# EAGLE design oneDpong (EAGLE 6.6.0)
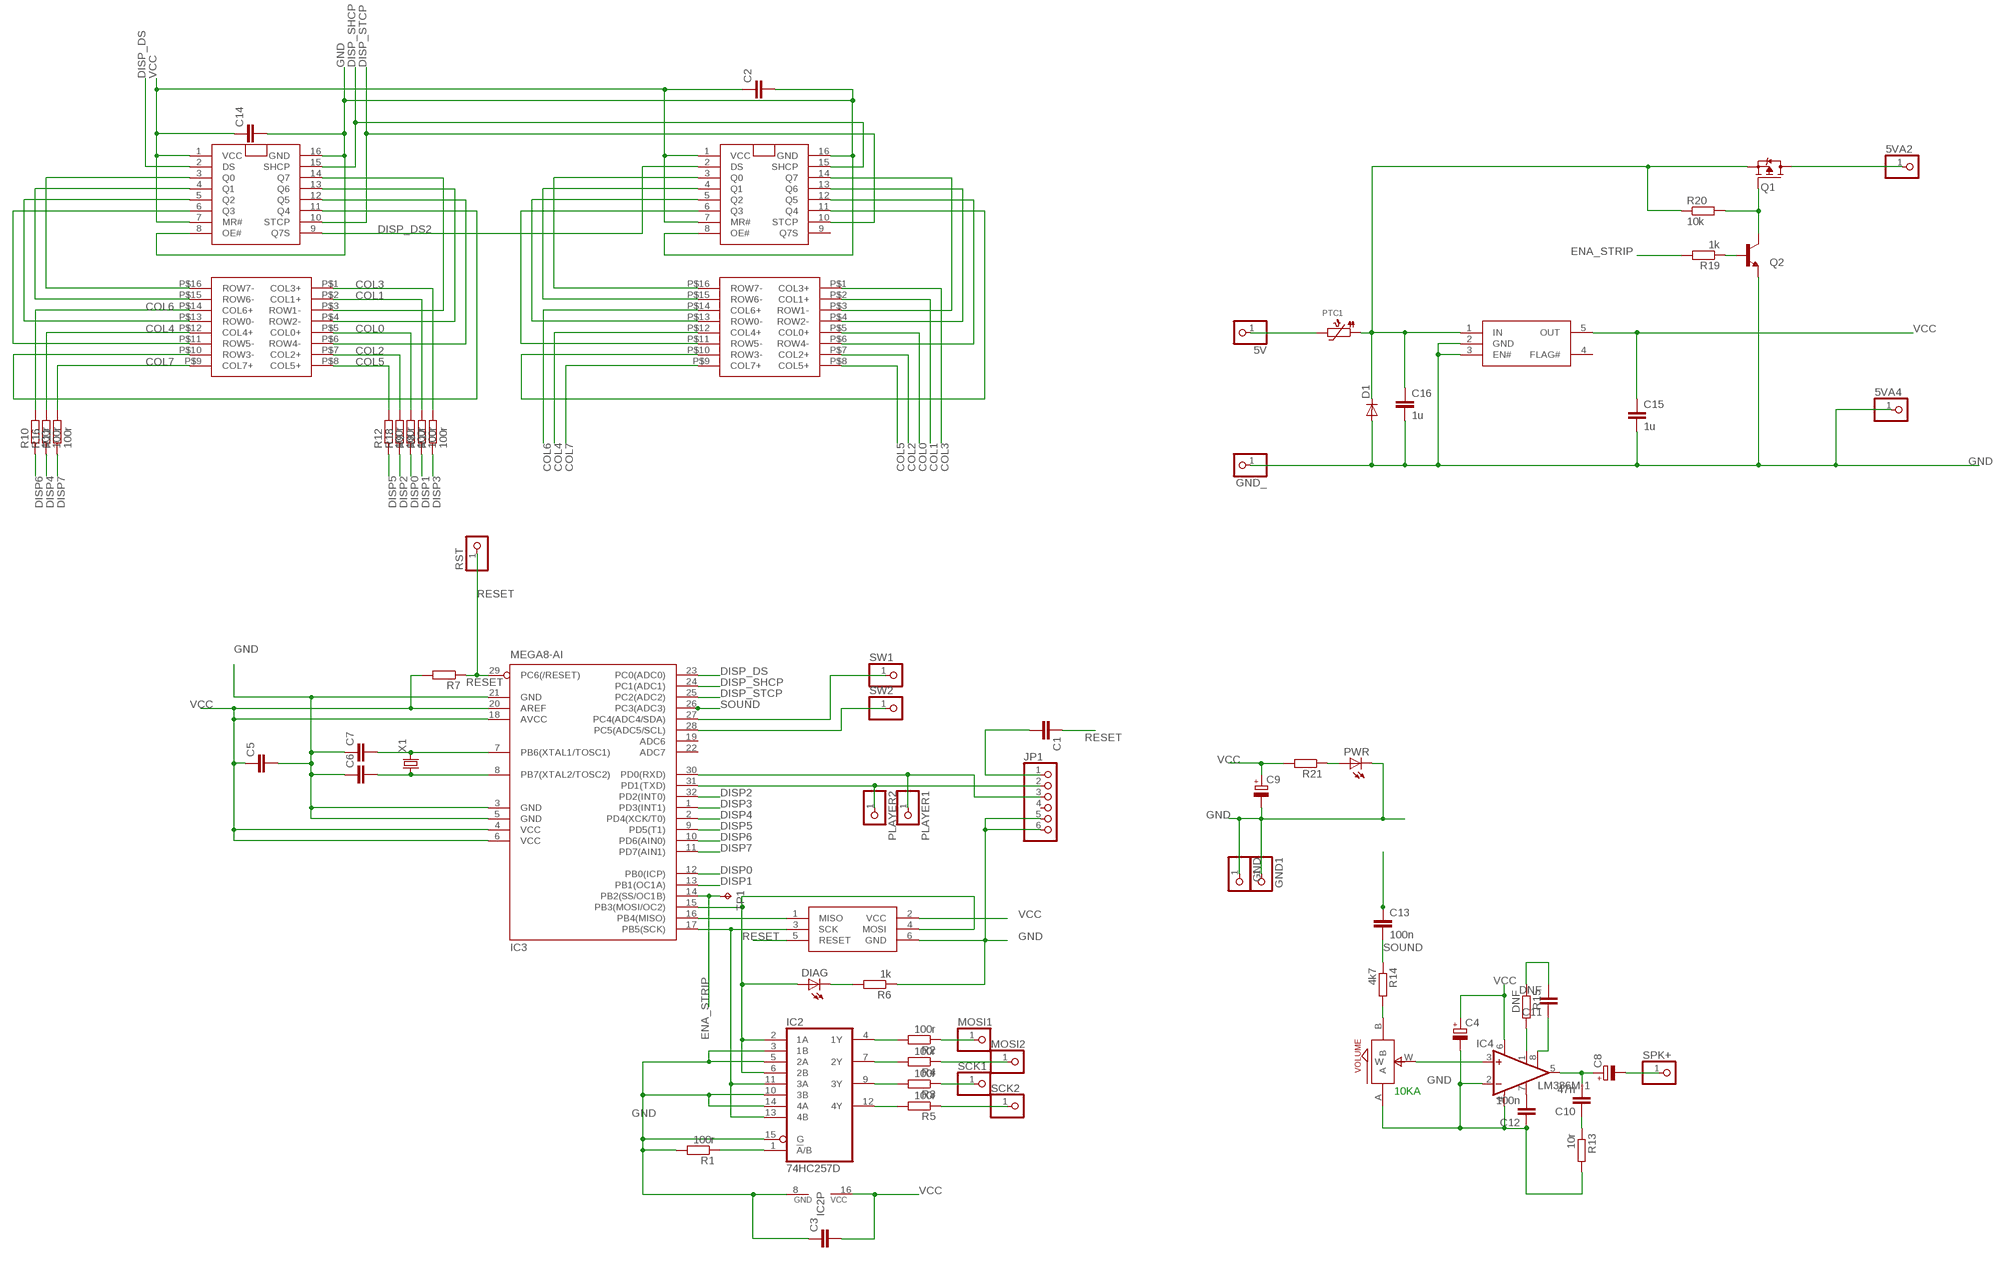
[diagram p0: schematic, sheet 1]

## Parts
5V  PINHD-1X1  [1X01]
5VA2  PINHD-1X1  [1X01]
5VA4  PINHD-1X1  [1X01]
C1  C-EUC0805  [C0805]
C2  C-EUC0805  [C0805]
C3  C-EUC0805  [C0805]
C4  CPOL-EUE2.5-6  [E2,5-6]
C5  C-EUC0805  [C0805]
C6  C-EUC0805  [C0805]
C7  C-EUC0805  [C0805]
C8  CPOL-EUE2.5-6  [E2,5-6]
C9  CPOL-EUE2.5-6  [E2,5-6]
C10  47n  C-EUC0805  [C0805]
C11  DNF  C-EUC0805  [C0805]
C12  100n  C-EUC0805  [C0805]
C13  100n  C-EUC0805  [C0805]
C14  C-EUC0805  [C0805]
C15  1u  C-EUC0805  [C0805]
C16  1u  C-EUC0805  [C0805]
D1  DIODE-SMC  [SMC]
DIAG  LED3MM  [LED3MM]
GND  PINHD-1X1  [1X01]
GND1  PINHD-1X1  [1X01]
GND_  PINHD-1X1  [1X01]
IC1  NPIC6C596  [SO16]
IC2  74HC257D  [SO16]
IC3  MEGA8-AI  [TQFP32-08]
IC4  LM386M-1  [SO08]
IC5  NPIC6C596  [SO16]
IC6  NCP361SNT1G  [SOT23-5]
ICSP  TAG_CONN_AVR  [TC2030-MCP-NL]
JP1  PINHD-1X6  [1X06]
MOSI1  PINHD-1X1  [1X01]
MOSI2  PINHD-1X1  [1X01]
PLAYER1  PINHD-1X1  [1X01]
PLAYER2  PINHD-1X1  [1X01]
PTC1  PTC1812  [PTC1812]
PWR  LED3MM  [LED3MM]
Q1  SPD30P06PTO252  [TO252]
Q2  MMBT3904LT1-NPN-SOT23-BEC  [SOT23-BEC]
R1  100r  R-EU_R0805  [R0805]
R2  100r  R-EU_R0805  [R0805]
R3  100r  R-EU_R0805  [R0805]
R4  100r  R-EU_R0805  [R0805]
R5  100r  R-EU_R0805  [R0805]
R6  1k  R-EU_R0805  [R0805]
R7  R-EU_R0805  [R0805]
R8  100r  R-EU_R0805  [R0805]
R9  100r  R-EU_R0805  [R0805]
R10  100r  R-EU_R0805  [R0805]
R11  100r  R-EU_R0805  [R0805]
R12  100r  R-EU_R0805  [R0805]
R13  10r  R-EU_R0805  [R0805]
R14  4k7  R-EU_R0805  [R0805]
R15  DNF  R-EU_R0805  [R0805]
R16  100r  R-EU_R0805  [R0805]
R17  100r  R-EU_R0805  [R0805]
R18  100r  R-EU_R0805  [R0805]
R19  1k  R-EU_R0805  [R0805]
R20  10k  R-EU_R0805  [R0805]
R21  R-EU_R0805  [R0805]
RST  PINHD-1X1  [1X01]
SCK1  PINHD-1X1  [1X01]
SCK2  PINHD-1X1  [1X01]
SPK+  PINHD-1X1  [1X01]
SW1  PINHD-1X1  [1X01]
SW2  PINHD-1X1  [1X01]
TP1  TPB1,27  [B1,27]
U$1  LARGE8X8  [LARGE8X8]
U$2  LARGE8X8  [LARGE8X8]
VOLUME  ALPS_POT_SMALL  [SMALL_ALPS_POT]
X1  CRYSTALHC49U-V  [HC49U-V]

## Nets
COL0: R9.2 U$1.P$5(COL0+) U$2.P$5(COL0+)
COL1: R8.2 U$1.P$2(COL1+) U$2.P$2(COL1+)
COL2: R18.2 U$1.P$7(COL2+) U$2.P$7(COL2+)
COL3: R17.2 U$1.P$1(COL3+) U$2.P$1(COL3+)
COL4: R16.2 U$1.P$12(COL4+) U$2.P$12(COL4+)
COL5: R12.2 U$1.P$8(COL5+) U$2.P$8(COL5+)
COL6: R10.2 U$1.P$14(COL6+) U$2.P$14(COL6+)
COL7: R11.2 U$1.P$9(COL7+) U$2.P$9(COL7+)
DISP0: IC3.12(PB0(ICP)) R9.1
DISP1: IC3.13(PB1(OC1A)) R8.1
DISP2: IC3.32(PD2(INT0)) R18.1
DISP3: IC3.1(PD3(INT1)) R17.1
DISP4: IC3.2(PD4(XCK/T0)) R16.1
DISP5: IC3.9(PD5(T1)) R12.1
DISP6: IC3.10(PD6(AIN0)) R10.1
DISP7: IC3.11(PD7(AIN1)) R11.1
DISP_DS: IC3.23(PC0(ADC0)) IC5.2(DS)
DISP_DS2: IC1.2(DS) IC5.9(Q7S)
DISP_SHCP: IC1.15(SHCP) IC3.24(PC1(ADC1)) IC5.15(SHCP)
DISP_STCP: IC1.10(STCP) IC3.25(PC2(ADC2)) IC5.10(STCP)
ENA_STRIP: IC3.14(PB2(SS/OC1B)) R19.2 TP1.TP
GND: 5VA4.1 C2.2 C3.1 C4.- C5.2 C6.1 C7.1 C9.- C12.1 C14.2 C15.2 C16.2 D1.A GND1.1 GND.1 GND_.1 IC1.8(OE#) IC1.16(GND) IC2.3(1B) IC2.5(2A) IC2.8(GND) IC2.10(3B) IC2.14(4A) IC2.15(G) IC3.3(GND) IC3.5(GND) IC3.21(GND) IC4.2(-IN) IC4.4(GND) IC5.8(OE#) IC5.16(GND) IC6.2(GND) IC6.3(EN#) ICSP.6(GND) JP1.5 JP1.6 PWR.K(C) Q2.E R1.2 R6.1 R13.2 VOLUME.A
MISO: IC3.16(PB4(MISO)) ICSP.1(MISO)
MOSI2: MOSI2.1 R4.1
N$1: IC3.30(PD0(RXD)) JP1.3 PLAYER1.1
N$2: IC2.1(!A!/B) R1.1
N$3: C7.2 IC3.7(PB6(XTAL1/TOSC1)) X1.2
N$4: C6.2 IC3.8(PB7(XTAL2/TOSC2)) X1.1
N$5: IC2.4(1Y) R2.2
N$6: IC2.7(2Y) R4.2
N$7: IC2.11(3A) IC2.13(4B) IC3.17(PB5(SCK)) ICSP.3(SCK)
N$8: C10.1 R13.1
N$9: C1.2 JP1.1
N$10: IC2.9(3Y) R3.2
N$11: IC2.12(4Y) R5.2
N$12: MOSI1.1 R2.1
N$13: 5VA2.1 Q1.3(D)
N$14: IC3.31(PD1(TXD)) JP1.2 PLAYER2.1
N$15: R5.1 SCK2.1
N$16: R14.2 VOLUME.B
N$17: IC4.3(+IN) VOLUME.W
N$18: IC3.28(PC5(ADC5/SCL)) SW2.1
N$19: C8.+ C10.2 IC4.5(OUT)
N$20: C8.- SPK+.1
N$21: C12.2 IC4.7(BYPASS)
N$22: IC4.1(GAIN) R15.2
N$23: C11.2 R15.1
N$24: C11.1 IC4.8(GAIN)
N$25: C13.2 R14.1
N$26: PWR.A R21.1
N$27: DIAG.K(C) R6.2
N$28: 5V.1 PTC1.P$2
N$29: Q1.1(G) Q2.C R20.2
N$30: Q2.B R19.1
PMOSI: DIAG.A IC2.2(1A) IC2.6(2B) IC3.15(PB3(MOSI/OC2)) ICSP.4(MOSI)
Q0A: IC5.3(Q0) U$1.P$16(ROW7-)
Q0A1: IC1.3(Q0) U$2.P$16(ROW7-)
Q1A: IC5.4(Q1) U$1.P$15(ROW6-)
Q1A1: IC1.4(Q1) U$2.P$15(ROW6-)
Q2A: IC5.5(Q2) U$1.P$13(ROW0-)
Q2A1: IC1.5(Q2) U$2.P$13(ROW0-)
Q3A: IC5.6(Q3) U$1.P$11(ROW5-)
Q3A1: IC1.6(Q3) U$2.P$11(ROW5-)
Q4A: IC5.11(Q4) U$1.P$10(ROW3-)
Q4A1: IC1.11(Q4) U$2.P$10(ROW3-)
Q5A: IC5.12(Q5) U$1.P$6(ROW4-)
Q5A1: IC1.12(Q5) U$2.P$6(ROW4-)
Q6A: IC5.13(Q6) U$1.P$4(ROW2-)
Q6A1: IC1.13(Q6) U$2.P$4(ROW2-)
Q7A: IC5.14(Q7) U$1.P$3(ROW1-)
Q7A1: IC1.14(Q7) U$2.P$3(ROW1-)
RESET: C1.1 IC3.29(PC6(/RESET)) ICSP.5(RESET) R7.1 RST.1
SCK1: R3.1 SCK1.1
SOUND: C13.1 IC3.26(PC3(ADC3))
SW1: IC3.27(PC4(ADC4/SDA)) SW1.1
VCC: C2.1 C3.2 C4.+ C5.1 C9.+ C14.1 C15.1 IC1.1(VCC) IC1.7(MR#) IC2.16(VCC) IC3.4(VCC) IC3.6(VCC) IC3.18(AVCC) IC3.20(AREF) IC4.6(VS) IC5.1(VCC) IC5.7(MR#) IC6.5(OUT) ICSP.2(VCC) R7.2 R21.2
VIN: C16.1 D1.C IC6.1(IN) PTC1.P$1 Q1.2(S) R20.1
Unconnected: IC1.9(Q7S) IC3.19(ADC6) IC3.22(ADC7) IC6.4(FLAG#) JP1.4

## Notes on the sheet
- 10KA

## Library data of the parts
5V 5VA2 5VA4 GND GND1 GND_ MOSI1 MOSI2 PLAYER1 PLAYER2 RST SCK1 SCK2 SPK+ SW1 SW2 = pinhead:PINHD-1X1: PIN HEADER
C1-C3 C5-C7 C10-C16 = rcl:C-EU: CAPACITOR, European symbol
C4 C8 C9 = rcl:CPOL-EU: POLARIZED CAPACITOR, European symbol
D1 = diode:DIODE-: DIODE
DIAG PWR = adafruit:LED: LED OSRAM: - CHIPLED LG R971, LG N971, LY N971, LG Q971, LY Q971, LO R971, LY R971 LH N974, LH R974 LS Q976, LO Q976, LY Q976 LO Q996 - Hyper CHIPLED LW Q18S LB Q993, LB Q99A, LB R99A - SideLED LS A670, LO A670, LY A670, LG A670, LP A670 LB A673, LV A673, LT A673, LW A673 LH A674 LY A675 LS A676, LA A676, LO A676, LY A676, LW A676 LS A679, LY A679, LG A679 - Hyper Micro SIDELED® LS Y876, LA Y876, LO Y876, LY Y876 LT Y87S - SmartLED LW L88C, LW L88S LB L89C, LB L89S, LG L890 LS L89K, LO L89K, LY L89K LS L896, LA L896, LO L896, LY L896 - TOPLED LS T670, LO T670, LY T670, LG T670, LP T670 LSG T670, LSP T670, LSY T670, LOP T670, LYG T670 LG T671, LOG T671, LSG T671 LB T673, LV T673, LT T673, LW T673 LH T674 LS T676, LA T676, LO T676, LY T676, LB T676, LH T676, LSB T676, LW T676 LB T67C, LV T67C, LT T67C, LS T67K, LO T67K, LY T67K, LW E67C LS E67B, LA E67B, LO E67B, LY E67B, LB E67C, LV E67C, LT E67C LW T67C LS T679, LY T679, LG T679 LS T770, LO T770, LY T770, LG T770, LP T770 LB T773, LV T773, LT T773, LW T773 LH T774 LS E675, LA E675, LY E675, LS T675 LS T776, LA T776, LO T776, LY T776, LB T776 LHGB T686 LT T68C, LB T68C - Hyper Mini TOPLED® LB M676 - Mini TOPLED Santana® LG M470 LS M47K, LO M47K, LY M47K Source: http://www.osram.convergy.de/
IC1 IC5 = jasons_stuff:NPIC6C596
IC2 = 74xx-eu:74*257: Quadruple 2-to 1 line data SELECTOR/MULTIPLEXER
IC3 = atmel:MEGA8: MICROCONTROLLER 8 Kbytes FLASH, 1 kbytes SRAM, 512 bytes EEPROM, USART, 6-channel 10 bit ADC, 2-channel 8 bit ADC Pin compatible with Atmega48, ATMega88, ATMega168 Source: avr.lbr; MPN: ATMEGA8-16AU; OC_FARNELL: 9171371; OC_NEWARK: 73M8863
IC4 = linear:LM386?-*: Low Voltage Audio Power Amplifier Source: http://cache.national.com/ds/LM/LM386.pdf
IC6 = jason_eagle6:NCP361SNT1G
ICSP = jasons_stuff:TAG_CONN_AVR
JP1 = pinhead:PINHD-1X6: PIN HEADER
PTC1 = microbuilder:PTC: PTC (Resettable Fuse) 1206 Package 250mA PTC (16V Max, Time-to-Trip: 0.08s) - Digikey: F2110CT-ND 1210 Package 100mA PTC (30V Max, Time-to-Trip: 0.6s) - Digikey: MF-USMF010-2CT-ND 1812 Package 750mA PTC (24V Max, Time-to-Trip: 0.2s) - Digikey: MF-MSMF075/24-2CT-ND
Q1 = transistor-fet:SPD30P06P: SIPMOS(R) Power-Transistor P-Channel, Enhancement mode Source: http://www.infineon.com/upload/Document/cmc_upload/documents/012/3615/SPD_U30P06P.pdf
Q2 = transistor:*-NPN-: NPN Transistror BF959 corrected 2008.03.06
R1-R21 = rcl:R-EU_: RESISTOR, European symbol
TP1 = testpad:TP: Test pad
U$1 U$2 = jasons_stuff:LARGE8X8
VOLUME = jasons_stuff:ALPS_POT_SMALL
X1 = crystal:CRYSTAL: CRYSTAL; OC_FARNELL: 1666969; OC_NEWARK: unknown

## Board
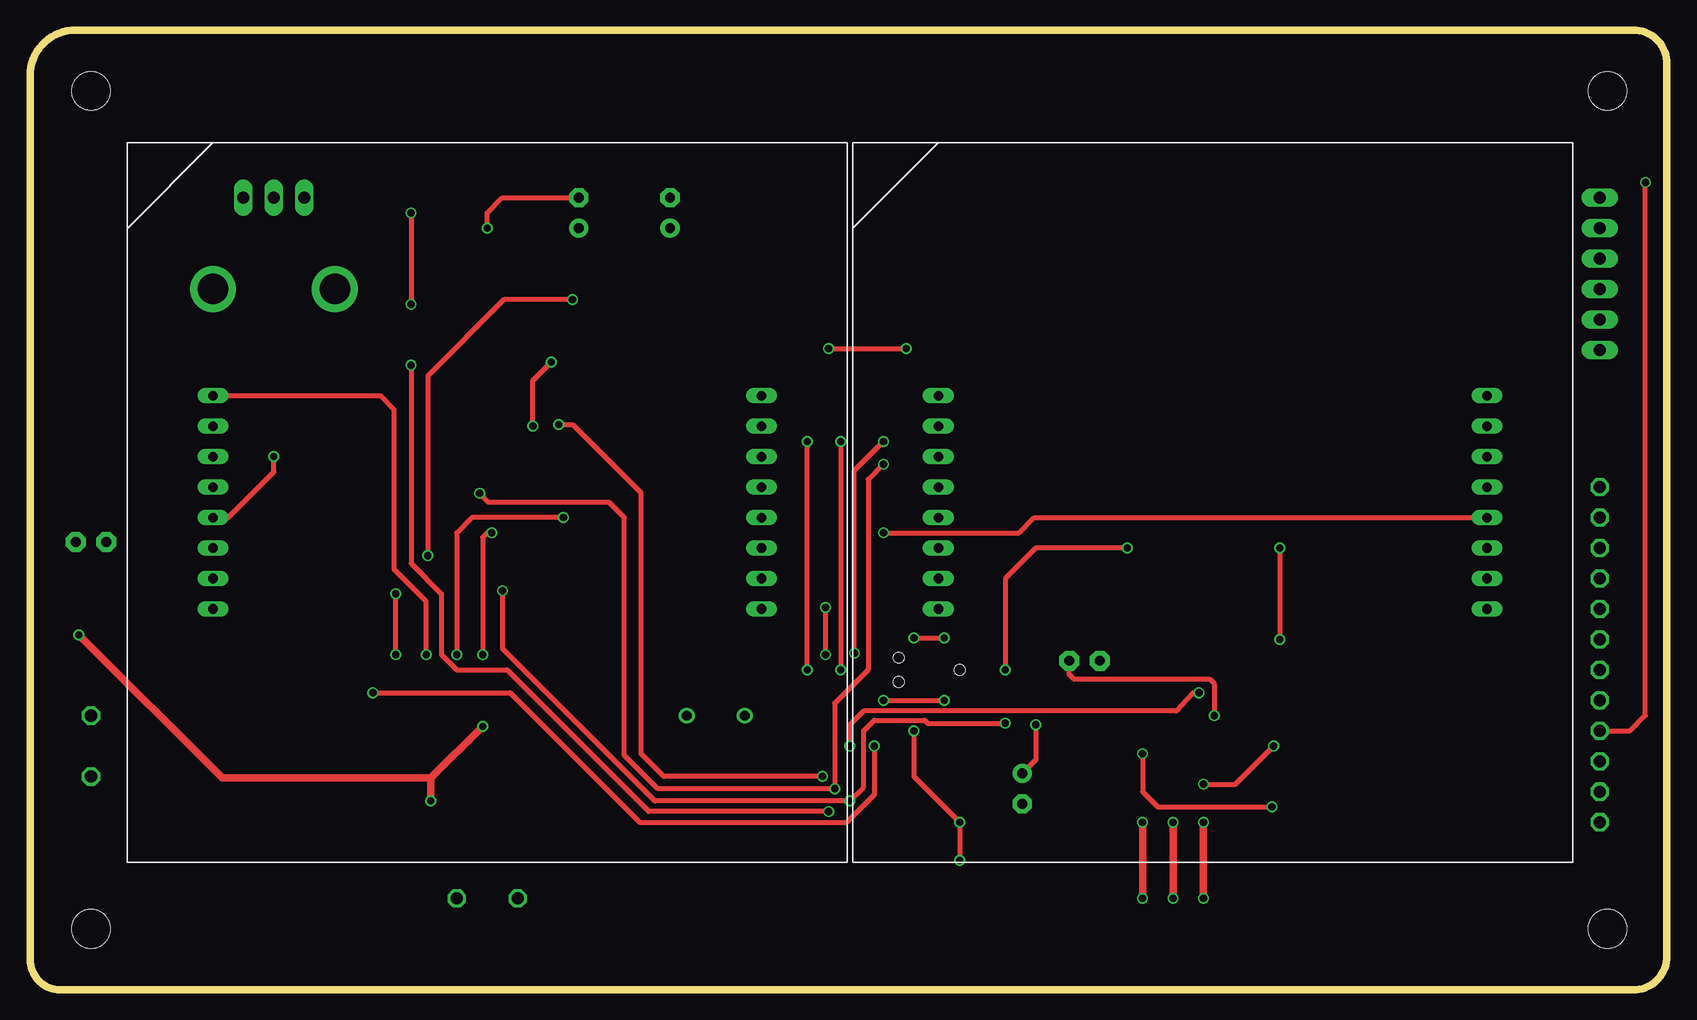
[diagram p1: board, top side]
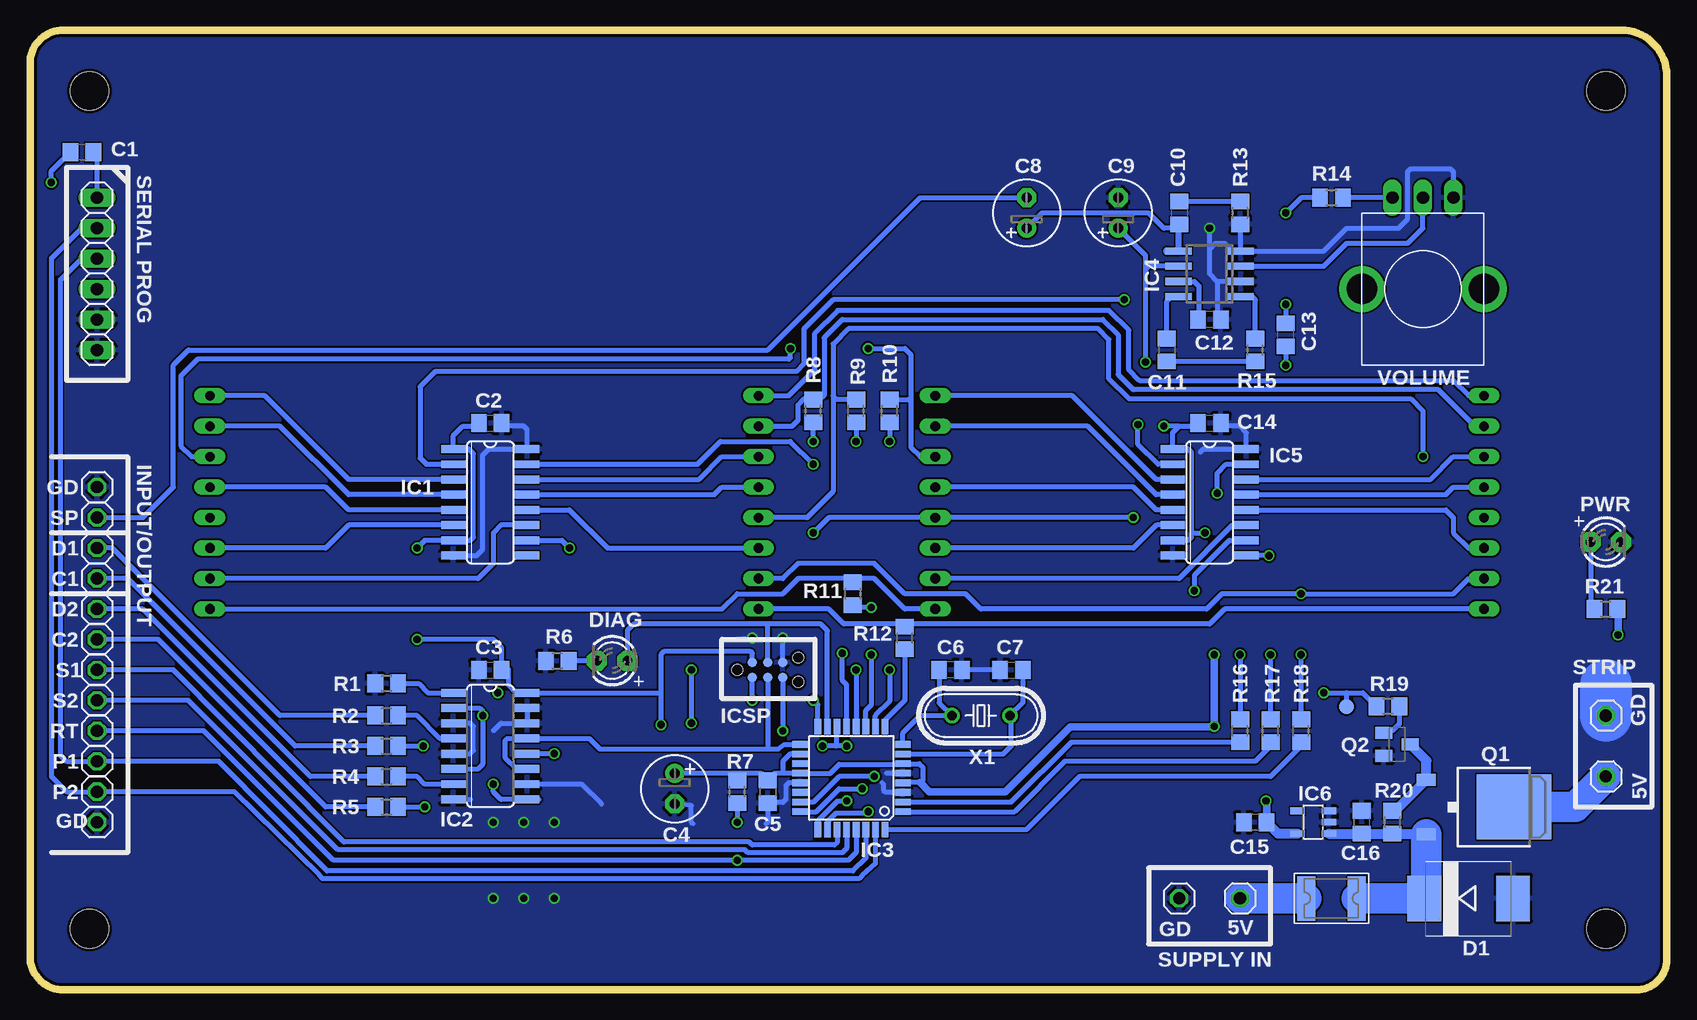
[diagram p2: board, bottom side, seen from below]

Size 136.4 x 80.03 mm. Coordinates in mm from the lower left corner, seen from the top.
Outline: 0,76.21 0,2.55 arc90 2.54,0.01 133.35,0.01 arc90 136.4,2.55 136.4,77.48 arc90 133.35,80.02 3.81,80.02 arc90 0,76.21
Copper layers (1*16): Top 0.035mm / dielectric 1.5mm / Bottom 0.035mm
Design rules "ITEADstudio_DRC": minimum track width 6mil, minimum drill 12mil, track to track 6mil, track to pad 6mil, pad to pad 6mil, via to via 6mil, smd to smd 0mil, copper to edge 10mil, drill to drill 10mil, minimum pad ring 10mil, minimum via ring 6mil, stop-mask expansion 2mil, vias tented up to drill 100mil, thermal gap 10mil
Holes 3.2 mm at 5.08,74.94 131.44,74.94 131.44,5.09 5.08,5.09

### Footprints (pad centres in the part's own frame; a part is rotated, then mirrored left to right if it is on the bottom)
1X01 = drill 1.016 octagon: 1 0,0
C0805 = smd 1.3 x 1.5: 1 -0.95,0; 2 0.95,0
E2,5-6 = drill 0.813 pad 1.6: + -1.27,0 | drill 0.813 pad 1.6 octagon: - 1.27,0
SMC = smd 2.8 x 3.8: A 3.7,0; C -3.7,0
LED3MM = drill 0.813 pad 1.676 octagon: A -1.27,0; K 1.27,0
SO16 = smd 0.66 x 2.032: 1 -4.445,-3.073; 2 -3.175,-3.073; 3 -1.905,-3.073; 4 -0.635,-3.073; 5 0.635,-3.073; 6 1.905,-3.073; 7 3.175,-3.073; 8 4.445,-3.073; 9 4.445,3.073; 10 3.175,3.073; 11 1.905,3.073; 12 0.635,3.073; 13 -0.635,3.073; 14 -1.905,3.073; 15 -3.175,3.073; 16 -4.445,3.073
TQFP32-08 = smd 1.27 x 0.559: 1 -4.293,2.8; 2 -4.293,2; 3 -4.293,1.2; 4 -4.293,0.4; 5 -4.293,-0.4; 6 -4.293,-1.2; 7 -4.293,-2; 8 -4.293,-2.8; 17 4.293,-2.8; 18 4.293,-2; 19 4.293,-1.2; 20 4.293,-0.4; 21 4.293,0.4; 22 4.293,1.2; 23 4.293,2; 24 4.293,2.8 | smd 0.559 x 1.27: 9 -2.8,-4.293; 10 -2,-4.293; 11 -1.2,-4.293; 12 -0.4,-4.293; 13 0.4,-4.293; 14 1.2,-4.293; 15 2,-4.293; 16 2.8,-4.293; 25 2.8,4.293; 26 2,4.293; 27 1.2,4.293; 28 0.4,4.293; 29 -0.4,4.293; 30 -1.2,4.293; 31 -2,4.293; 32 -2.8,4.293
SO08 = smd 0.6 x 2.2: 1 -1.905,-2.6; 2 -0.635,-2.6; 3 0.635,-2.6; 4 1.905,-2.6; 5 1.905,2.6; 6 0.635,2.6; 7 -0.635,2.6; 8 -1.905,2.6
SOT23-5 = smd 0.55 x 1.2: 1 -0.95,-1.3; 2 0,-1.3; 3 0.95,-1.3; 4 0.95,1.3; 5 -0.95,1.3
TC2030-MCP-NL = smd 0.787 x 0.787: 1 1.27,-0.635; 2 1.27,0.635; 3 2.54,-0.635; 4 2.54,0.635; 5 3.81,-0.635; 6 3.81,0.635 | hole 0.889: 0,0; 5.08,-1.016; 5.08,1.016
1X06 = drill 1.016 long: 1 -6.35,0; 2 -3.81,0; 3 -1.27,0; 4 1.27,0; 5 3.81,0; 6 6.35,0
PTC1812 = smd 1.5 x 3.7: P$1 -2.1,0; P$2 2.1,0
TO252 = smd 1 x 1.6: 1 -2.28,-4.8; 2 2.28,-4.8 | smd 5.4 x 6.2: 3 0,2.5
SOT23-BEC = smd 1 x 1.4: B -0.95,-1.1; C 0,1.1; E 0.95,-1.1
R0805 = smd 1.3 x 1.5: 1 -0.95,0; 2 0.95,0
B1,27 = smd 1.27 x 1.27: TP 0,0
LARGE8X8 = drill 0.8 long: P$1 -22.86,8.89; P$2 -22.86,6.35; P$3 -22.86,3.81; P$4 -22.86,1.27; P$5 -22.86,-1.27; P$6 -22.86,-3.81; P$7 -22.86,-6.35; P$8 -22.86,-8.89; P$9 22.86,-8.89; P$10 22.86,-6.35; P$11 22.86,-3.81; P$12 22.86,-1.27; P$13 22.86,1.27; P$14 22.86,3.81; P$15 22.86,6.35; P$16 22.86,8.89
SMALL_ALPS_POT = drill 1.016 long: A -2.54,-7.62; B 2.54,-7.62; W 0,-7.62 | drill 2.54 pad 3.81: GND@1 -5.08,0; GND@2 5.08,0
HC49U-V = drill 0.813: 1 -2.413,0; 2 2.413,0

### Placement (x,y rotation side)
5V  35.56,7.63 0 bottom
5VA2  5.08,17.79 0 bottom
5VA4  5.08,22.87 0 bottom
C1  132.08,69.86 0 bottom
C2  98.04,47.26 0 bottom
C3  98.04,26.68 0 bottom
C4  82.68,16.78 270 bottom
C5  74.93,16.52 270 bottom
C6  59.69,26.68 180 bottom
C7  54.61,26.68 0 bottom
C8  53.34,64.78 90 bottom
C9  45.72,64.78 90 bottom
C10  40.64,64.78 270 bottom
C11  41.66,53.35 270 bottom
C12  38.1,55.89 180 bottom
C13  31.75,54.62 90 bottom
C14  38.1,47.26 0 bottom
C15  34.29,13.98 180 bottom
C16  25.4,13.98 90 bottom
D1  16.51,7.63 0 bottom
DIAG  87.88,27.44 180 bottom
GND  130.81,41.92 0 bottom
GND1  130.81,13.98 0 bottom
GND_  40.64,7.63 0 bottom
IC1  98.04,40.65 270 bottom
IC2  98.04,20.33 270 bottom
IC3  67.94,17.66 180 bottom
IC4  38.1,59.7 90 bottom
IC5  38.1,40.65 270 bottom
IC6  29.46,13.98 90 bottom
ICSP  77.47,26.68 0 bottom
JP1  130.81,59.7 270 bottom
MOSI1  130.81,36.84 0 bottom
MOSI2  130.81,31.76 0 bottom
PLAYER1  130.81,19.06 0 bottom
PLAYER2  130.81,16.52 0 bottom
PTC1  27.94,7.63 180 bottom
PWR  5.08,37.35 0 bottom
Q1  15.24,15.25 270 bottom
Q2  22.48,20.46 270 bottom
R1  106.68,25.54 180 bottom
R2  106.68,22.87 0 bottom
R3  106.68,20.33 0 bottom
R4  106.68,17.79 0 bottom
R5  106.68,15.25 0 bottom
R6  92.46,27.44 0 bottom
R7  77.47,16.52 90 bottom
R8  71.12,48.27 90 bottom
R9  67.56,48.27 90 bottom
R10  64.77,48.27 90 bottom
R11  67.82,33.03 90 bottom
R12  63.5,29.35 90 bottom
R13  35.56,64.78 270 bottom
R14  27.94,66.05 0 bottom
R15  34.29,53.35 90 bottom
R16  35.56,21.6 90 bottom
R17  33.02,21.6 90 bottom
R18  30.48,21.6 90 bottom
R19  23.24,23.63 180 bottom
R20  22.86,13.98 90 bottom
R21  5.08,31.76 0 bottom
RST  130.81,21.6 0 bottom
SCK1  130.81,34.3 0 bottom
SCK2  130.81,29.22 0 bottom
SPK+  130.81,39.38 0 bottom
SW1  130.81,26.68 0 bottom
SW2  130.81,24.14 0 bottom
TP1  26.67,23.63 0 bottom
U$1  38.1,40.65 0 top
U$2  98.55,40.65 0 top
VOLUME  20.32,58.43 180 bottom
X1  57.15,22.87 0 bottom

### Tracks (layer width: path | path; a pad name or v marks a point on that pad's centre or on a via)
COL0  (via drill 0.6)
  Top 0.406: U$1.P$5 16.51,39.38 20.32,43.19 v20.32,44.46
  Bottom 0.406: 69.47,49.54 69.47,53.86 68.2,55.13 47.37,55.13 46.48,54.24 46.48,50.94 44.83,49.29 21.34,49.29 20.32,48.27 v20.32,44.46 | 69.47,49.54 69.47,41.54 71.63,39.38 U$2.P$5 | R9.2 69.15,49.22 69.47,49.54
COL1
  Bottom 0.406: U$1.P$2 16,47 19.05,50.05 44.45,50.05 45.72,51.32 45.72,54.62 46.99,55.89 68.71,55.89 70.23,54.37 70.23,49.54 70.61,49.16 70.67,49.22 R8.2 71.19,49.29 71.88,49.29 72.39,48.78 72.39,47.51 72.9,47 U$2.P$2
COL2  (via drill 0.6)
  Top 0.406: v30.48,27.95 v30.48,33.03
  Bottom 0.406: U$2.P$7 73.66,34.3 72.39,35.57 66.04,35.57 63.5,33.03 58.42,33.03 57.15,31.76 38.35,31.76 37.08,33.03 v30.48,33.03 17.78,33.03 16.51,34.3 U$1.P$7 | R18.2 v30.48,27.95
COL3  (via drill 0.6)
  Top 0.406: v33.02,27.95 33.02,32.4 30.35,35.06 30.35,48.4 29.21,49.54 U$1.P$1
  Bottom 0.406: U$1.P$1 16.51,49.54 17.78,50.81 43.94,50.81 44.83,51.7 44.83,55 46.48,56.65 69.09,56.65 70.99,54.75 70.99,51.7 73.15,49.54 U$2.P$1 | R17.2 v33.02,27.95
COL4  (via drill 0.6)
  Top 0.406: v44.45,39.38 36.83,39.38 35.56,38.11 v35.56,27.95 | v71.12,38.11 82.42,38.11 83.69,39.38 U$2.P$12
  Bottom 0.406: v35.56,27.95 R16.2 | v44.45,39.38 U$1.P$12 69.85,39.38 v71.12,38.11
COL5
  Bottom 0.406: U$1.P$8 36.83,31.76 38.1,30.49 63.5,30.49 | 63.5,30.49 68.58,30.49 69.85,31.76 U$2.P$8 | R12.2 63.5,30.49
COL6  (via drill 0.6)
  Top 0.406: v66.55,53.48 v73.03,53.48
  Bottom 0.406: U$2.P$14 122.94,44.46 123.82,45.35 123.82,51.19 122.43,52.59 73.15,52.59 73.03,52.72 v73.03,53.48 | U$1.P$14 62.23,44.46 62.99,45.22 62.99,49.03 | v66.55,53.48 63.5,53.48 62.99,52.97 62.99,49.03 | R10.2 63.18,49.22 62.99,49.03
COL7
  Bottom 0.406: U$2.P$9 78.74,31.76 77.47,33.03 73.66,33.03 72.39,34.3 67.31,34.3 | U$1.P$9 63.5,31.76 66.04,34.3 67.31,34.3 | R11.2 67.63,33.98 67.31,34.3
DISP0  (via drill 0.6)
  Top 0.406: v67.56,45.73 v67.56,26.68
  Bottom 0.406: R9.1 v67.56,45.73 | v67.56,26.68 67.56,21.98 IC3.12
DISP1  (via drill 0.6)
  Top 0.406: v68.71,28.08 68.71,43.32 v71.12,45.73
  Bottom 0.406: IC3.13 68.34,25.43 68.71,25.79 v68.71,28.08 | v71.12,45.73 R8.1
DISP2
  Bottom 0.406: IC3.32 53.34,13.37 48.92,17.79 33.02,17.79 30.48,20.33 R18.1
DISP3
  Bottom 0.406: IC3.1 54.36,14.86 50.16,19.06 34.29,19.06 33.02,20.33 R17.1
DISP4
  Bottom 0.406: IC3.2 54.61,15.66 49.62,20.65 R16.1
DISP5
  Bottom 0.406: IC3.9 65.15,22.5 63.5,24.14 R12.1
DISP6  (via drill 0.6)
  Top 0.406: 64.77,45.22 v64.77,45.73 v64.77,26.68
  Bottom 0.406: IC3.10 65.94,22.87 64.77,24.05 v64.77,26.68 | R10.1 v64.77,45.73
DISP7  (via drill 0.6)
  Top 0.406: v66.29,27.95 v66.29,31.89
  Bottom 0.406: v66.29,31.89 67.62,31.89 R11.1 | v66.29,27.95 66.29,23.76 66.75,23.31 IC3.11
DISP_DS  (via drill 0.6)
  Top 0.406: v44.07,47.13 45.21,47.13 50.93,41.41 50.93,19.7 52.83,17.79 v66.04,17.79
  Bottom 0.406: IC5.2 42.42,43.83 44.07,45.48 v44.07,47.13 | IC3.23 71.09,15.66 68.96,17.79 v66.04,17.79
DISP_DS2  (via drill 0.6)
  Top 0.406: v45.21,57.54 39.5,57.54 33.15,51.19 v33.15,36.21
  Bottom 0.406: v45.21,57.54 69.47,57.54 71.88,55.13 71.88,52.21 72.52,51.57 102.62,51.57 103.89,50.3 103.89,44.33 103.38,43.83 IC1.2 | v33.15,36.21 IC5.9
DISP_SHCP  (via drill 0.6)
  Top 0.406: v37.47,41.41 38.23,40.65 48.26,40.65 49.53,39.38 49.53,19.57 52.32,16.78 v67.06,16.78 67.06,23.89 69.85,26.68 69.85,42.56 v71.12,43.83
  Bottom 0.406: v37.47,41.41 37.47,43.06 36.7,43.83 IC5.15 | IC1.15 80.77,43.83 78.87,45.73 73.03,45.73 v71.12,43.83 | IC3.24 70.87,14.86 68.96,16.78 v67.06,16.78
DISP_STCP  (via drill 0.6)
  Top 0.406: v39.37,33.29 39.37,28.46 52.07,15.76 v68.33,15.76 69.47,16.9 69.47,21.6 70.36,22.49 74.55,22.49 74.8,22.24 v81.28,22.24 | v91.44,36.84 83.82,36.84 81.28,34.3 v81.28,26.68
  Bottom 0.406: IC3.25 70.75,14.1 69.09,15.76 v68.33,15.76 | IC5.10 36.45,37.48 39.37,34.56 v39.37,33.29 | IC1.10 92.07,37.48 v91.44,36.84 | v81.28,26.68 v81.28,22.24
ENA_STRIP  (via drill 0.6)
  Top 0.406: v28.58,24.78 40.01,24.78 50.8,13.98 68.07,13.98 70.36,16.27 v70.36,20.33 | v97.41,24.78 96.9,24.78 95.5,23.25 69.47,23.25 68.33,22.11 v68.33,20.33
  Bottom 0.406: v68.33,20.33 69.22,20.33 | 69.22,20.33 v70.36,20.33 | IC3.14 69.22,21.89 69.22,20.33 | v28.58,24.78 26.67,24.78 | 26.67,24.78 25.33,24.78 R19.2 | TP1.TP 26.67,24.78
GND  (via drill 0.6)
  Top 0.406: v73.66,29.35 v76.2,29.35 | v38.1,63.51 38.1,64.78 39.37,66.05 C9.-
  Top 0.61: v95.25,13.98 v95.25,7.63 | v92.71,13.98 v92.71,7.63 | v97.79,13.98 v97.79,7.63
  Bottom 0.406: IC4.4 36.2,61.61 36.83,62.24 37.59,62.24 38.1,61.73 | IC4.4 28.58,61.61 26.67,63.51 22.35,63.51 21.59,64.27 21.59,68.21 21.34,68.46 18.03,68.46 17.78,68.21 VOLUME.A | IC4.2 37.47,59.07 | 37.47,59.07 38.1,59.7 38.1,61.73 | 37.47,59.07 37.47,56.21 C12.1 | C14.2 36.9,47 35.56,47 35.03,46.47 IC5.16 38.61,45.1 38.86,44.84 | C2.2 96.84,47 95.25,47 94.97,46.72 IC1.16 98.17,45.1 98.68,44.59 98.68,36.71 99.19,36.21 IC1.8 | C7.1 C6.1 | IC3.5 65,18.06 | IC3.3 63.71,16.52 65.15,16.52 65.28,16.65 65.28,17.16 65.39,17.26 | ICSP.6 v73.66,29.35 | v76.2,29.35 77.47,29.22 | IC3.21 73.17,17.26 73.41,17.03 73.41,15.89 73.66,15.63 74.87,15.63 C5.2 74.93,13.98 75.06,13.85 | 81.15,13.85 81.28,13.98 81.28,15.38 C4.- | 88.77,15.51 90.42,17.16 IC2.10 | IC2.15 IC2.14 97.16,22.24 97.79,21.6 | IC2.8 99.69,15.89 | IC2.5 99.69,19.7 99.44,19.95 99.44,21.98 99.69,22.24 IC2.3 | R13.2 35.56,61.67 IC4.4 | 38.1,61.73 v38.1,63.51
  Bottom 4.318: 5.08,25.41 5VA4.1
  pour Bottom: -1.27,81.29 -1.27,-1.26 138.43,-1.26 138.43,81.29
MISO  (via drill 0.6)
  Top 0.406: v71.12,24.14 v76.2,24.14
  Bottom 0.406: v71.12,24.14 70.75,23.77 IC3.16 | v76.2,24.14 ICSP.1
MOSI2
  Bottom 0.406: R4.1 113.03,17.79 127,31.76 MOSI2.1
N$1
  Bottom 0.406: IC3.30 66.75,10.99 67.82,9.92 111.63,9.92 111.89,10.17 120.65,19.06 PLAYER1.1 133.35,19.06 133.86,19.57 133.86,59.19 132.08,60.97 JP1.3
N$2
  Bottom 0.406: R1.1 104.01,25.54 103.25,24.78 IC2.1
N$3
  Bottom 0.406: IC3.7 55.28,19.66 54.61,20.33 54.61,22.74 X1.2 53.66,23.95 C7.2
N$4
  Bottom 0.406: IC3.8 63.65,21.45 62.23,22.87 X1.1 60.64,23.95 C6.2
N$5
  Bottom 0.406: IC2.4 102.24,20.97 104.14,22.87 R2.2
N$6
  Bottom 0.406: IC2.7 103.5,17.16 104.14,17.79 R4.2
N$7
  Bottom 0.406: IC2.11 95.88,18.43 96.77,19.32 96.77,20.84 96.65,20.97 IC2.13 89.79,20.97 88.9,20.08 74.93,20.08 | 74.93,20.08 74.04,20.08 73.53,20.46 IC3.17 | ICSP.3 74.93,20.08
N$8
  Bottom 0.406: R13.1 C10.1
N$9
  Bottom 0.406: JP1.1 130.81,69.54 C1.2
N$10  (via drill 0.6)
  Top 0.406: v97.79,17.16 100.46,17.16 v103.63,20.33
  Bottom 0.406: R3.2 v103.63,20.33 | 93.98,15.89 IC2.9 97.16,15.89 97.79,16.52 v97.79,17.16
N$11  (via drill 0.6)
  Top 0.406: v92.71,19.7 92.71,16.52 93.98,15.25 v103.5,15.25
  Bottom 0.406: R5.2 v103.5,15.25 | v92.71,19.7 IC2.12
N$12
  Bottom 0.406: R2.1 115.57,22.87 129.54,36.84 MOSI1.1
N$13
  Bottom 2.54: Q1.3 7.62,15.25 5VA2.1
N$14
  Bottom 0.406: IC3.31 65.94,10.52 67.06,9.54 67.31,9.28 112.01,9.28 112.27,9.54 119.38,16.52 PLAYER2.1 133.35,16.52 134.62,17.79 134.62,60.97 132.08,63.51 JP1.2
N$15
  Bottom 0.406: R5.1 111.76,15.25 125.73,29.22 SCK2.1
N$16
  Bottom 0.406: VOLUME.B R14.2
N$17
  Bottom 0.406: IC4.3 28.58,60.34 26.67,62.24 21.59,62.24 20.32,63.51 VOLUME.W
N$18
  Bottom 0.406: IC3.28 68.34,11.8 68.71,11.44 76.58,11.44 76.84,11.7 110.74,11.7 123.19,24.14 SW2.1
N$19
  Bottom 0.406: 40.64,61.61 IC4.5 40.7,63.77 C10.2 | 40.64,61.61 40.01,61.61 | 40.64,61.61 40.64,63.51 41.91,63.51 43.18,64.78 52.07,64.78 C8.+
  Bottom 0.61: 41.66,61.61 IC4.5
N$20
  Bottom 0.406: SPK+.1 127,39.38 124.46,41.92 124.46,52.08 123.19,53.35 74.93,53.35 62.23,66.05 C8.-
N$21
  Bottom 0.406: IC4.7 39.37,59.07 38.99,58.69 38.99,55.95 C12.2
N$22
  Bottom 0.406: R15.2 34.29,57.54 34.54,57.8 IC4.1
N$23
  Bottom 0.406: R15.1 C11.2
N$24
  Bottom 0.406: C11.1 41.66,57.42 41.27,57.8 IC4.8
N$25  (via drill 0.6)
  Top 0.406: v31.75,64.78 v31.75,57.16
  Bottom 0.406: R14.1 30.48,66.05 v31.75,64.78 | v31.75,57.16 C13.2
N$26
  Bottom 0.406: PWR.A 6.35,32.08 R21.1
N$27
  Bottom 0.406: DIAG.K R6.2
N$28
  Bottom 2.54: 5V.1 PTC1.P$2
N$29
  Bottom 0.813: R20.2 22.64,14.93 Q1.1 20.04,19.12 Q2.C
N$30
  Bottom 0.406: R19.1 22.29,22.17 22.86,21.6 23.39,21.6 Q2.B
PMOSI  (via drill 0.6)
  Top 0.406: v98.68,22.87 98.68,25.54 98.3,25.92 87,25.92 86.61,26.3 DIAG.A
  Bottom 0.406: IC3.15 69.94,29.95 70.49,30.49 74.93,30.49 | IC2.6 99.06,18.43 98.68,18.81 v98.68,22.87 98.68,23.25 98.93,23.51 IC2.2 | 74.93,30.49 86.11,30.49 86.61,29.98 DIAG.A | ICSP.4 74.93,30.49
Q0A
  Bottom 0.406: IC5.3 42.55,42.56 49.53,49.54 U$1.P$16
Q0A1
  Bottom 0.406: IC1.3 109.85,42.56 116.84,49.54 U$2.P$16
Q1A
  Bottom 0.406: IC5.4 42.55,41.29 48.26,47 U$1.P$15
Q1A1
  Bottom 0.406: IC1.4 109.85,41.29 115.57,47 U$2.P$15
Q2A
  Bottom 0.406: IC5.5 42.55,40.02 44.45,41.92 U$1.P$13
Q2A1
  Bottom 0.406: IC1.5 109.85,40.02 111.76,41.92 U$2.P$13
Q3A
  Bottom 0.406: IC5.6 42.55,38.75 44.45,36.84 U$1.P$11
Q3A1
  Bottom 0.406: IC1.6 109.85,38.75 111.76,36.84 U$2.P$11
Q4A
  Bottom 0.406: U$1.P$10 40.64,34.3 36.2,38.75 IC5.11
Q4A1
  Bottom 0.406: IC1.11 97.16,38.75 97.79,38.11 97.79,35.57 99.06,34.3 U$2.P$10
Q5A
  Bottom 0.406: IC5.12 18.41,40.02 17.78,39.38 17.78,38.11 16.51,36.84 U$1.P$6
Q5A1
  Bottom 0.406: IC1.12 91.44,40.02 88.26,36.84 U$2.P$6
Q6A
  Bottom 0.406: IC5.13 18.41,41.29 17.78,41.92 U$1.P$4
Q6A1
  Bottom 0.406: IC1.13 79.38,41.29 78.74,41.92 U$2.P$4
Q7A
  Bottom 0.406: IC5.14 19.68,42.56 17.78,44.46 U$1.P$3
Q7A1
  Bottom 0.406: IC1.14 80.65,42.56 78.74,44.46 U$2.P$3
RESET  (via drill 0.6)
  Top 0.406: RST.1 133.35,21.6 134.62,22.87 v134.62,67.32 | v77.47,10.81 v77.47,13.98 73.66,17.79 v73.66,21.6
  Bottom 0.406: RST.1 121.92,21.6 111.12,10.81 v77.47,10.81 68.2,10.81 67.54,11.46 IC3.29 | ICSP.5 v73.66,21.6 | R7.1 v77.47,13.98 | v134.62,67.32 134.62,68.27 C1.1
SCK1
  Bottom 0.406: R3.1 114.3,20.33 128.27,34.3 SCK1.1
SOUND  (via drill 0.6)
  Top 0.406: v31.75,52.08 31.75,35.57 34.29,33.03 34.29,27.95 35.56,26.68 39.75,26.68 51.56,14.87 v66.55,14.87
  Bottom 0.406: C13.1 v31.75,52.08 | 69.98,13.34 IC3.26 69.94,14.01 69.22,14.74 66.68,14.74 v66.55,14.87
SW1
  Bottom 0.406: IC3.27 69.15,12.27 69.34,12.08 76.2,12.08 76.45,12.33 110.24,12.33 110.87,12.97 124.46,26.68 SW1.1
VCC  (via drill 0.6)
  Top 0.406: v104.14,36.84 v104.14,29.22 | v38.48,38.11 38.1,38.11 37.72,37.73 v37.72,27.95 | v41.91,47 41.91,50.81 v43.43,52.34 | v83.82,22.11 83.82,19.19 C4.+
  Top 0.61: v33.4,15.76 33.4,17.66 | 33.4,17.66 v37.72,21.98 | 33.4,17.66 16,17.66 v4.06,29.6
  Bottom 0.406: 40.64,47 39.3,47 | 39.3,47 C14.1 39.05,47.07 39.12,47 39.3,47 | C2.1 99.25,47 100.33,47 101.12,46.21 IC1.1 99.82,45.1 99.44,44.72 99.44,37.73 99.69,37.48 IC1.7 103.5,37.48 v104.14,36.84 | 39.62,38.11 39.62,44.84 39.88,45.1 IC5.1 41.17,46.47 40.64,47 | IC5.7 39.88,37.48 39.62,37.73 39.62,38.11 | IC4.6 43.18,60.34 43.43,60.08 | IC3.4 63.63,17.28 62.23,17.28 61.98,17.54 61.98,18.55 62.29,18.86 IC3.6 63.71,18.81 68.96,18.81 69.72,18.05 72.22,18.05 IC3.20 73.66,18.06 | IC3.18 73.06,19.66 73.66,19.06 73.66,18.06 | 40.64,47 v41.91,47 | 73.66,18.06 74.34,18.06 C5.1 74.93,17.54 75.44,18.05 76.9,18.05 | 83.82,24.65 83.82,27.95 83.57,28.21 76.33,28.21 76.2,28.08 ICSP.2 | 83.82,24.65 v83.82,22.11 | v104.14,29.22 97.79,29.22 97.09,28.53 C3.2 96.52,26.74 96.52,25.41 95.88,24.78 IC2.16 83.95,24.78 83.82,24.65 | 76.9,18.05 C4.+ | 39.62,38.11 v38.48,38.11 | v43.43,52.34 43.43,60.08 | 76.9,18.05 R7.2 | 43.43,60.08 43.43,61.23 C9.+ | 4.19,31.7 R21.2
  Bottom 0.61: 62.23,17.28 61.47,16.52 55.12,16.52 49.72,21.92 37.78,21.92 v37.72,21.98 v37.72,27.95 | C15.1 33.34,15.7 v33.4,15.76 | v4.06,29.6 4.06,31.7 R21.2
  Bottom 0.813: IC6.5 32.39,13.03 C15.1
VIN
  Bottom 0.813: IC6.1 C16.1 R20.1 20.1,13.03 Q1.2
  Bottom 2.54: PTC1.P$1 D1.C 20.04,7.63 Q1.2

### Text on the board
bPlace: SERIAL PROG | INPUT/OUTPUT | GD | SP | D1 | C1 | D2 | C2 | S1 | STRIP | S2 | GD | RT | P1 | P2 | 5V | GD | 5V | GD | SUPPLY IN
bDocu: six4pix.com/pong1d | mainboard rev 3 | hotchk155 | creativecommons.org/licenses/by-nc-sa/4.0/